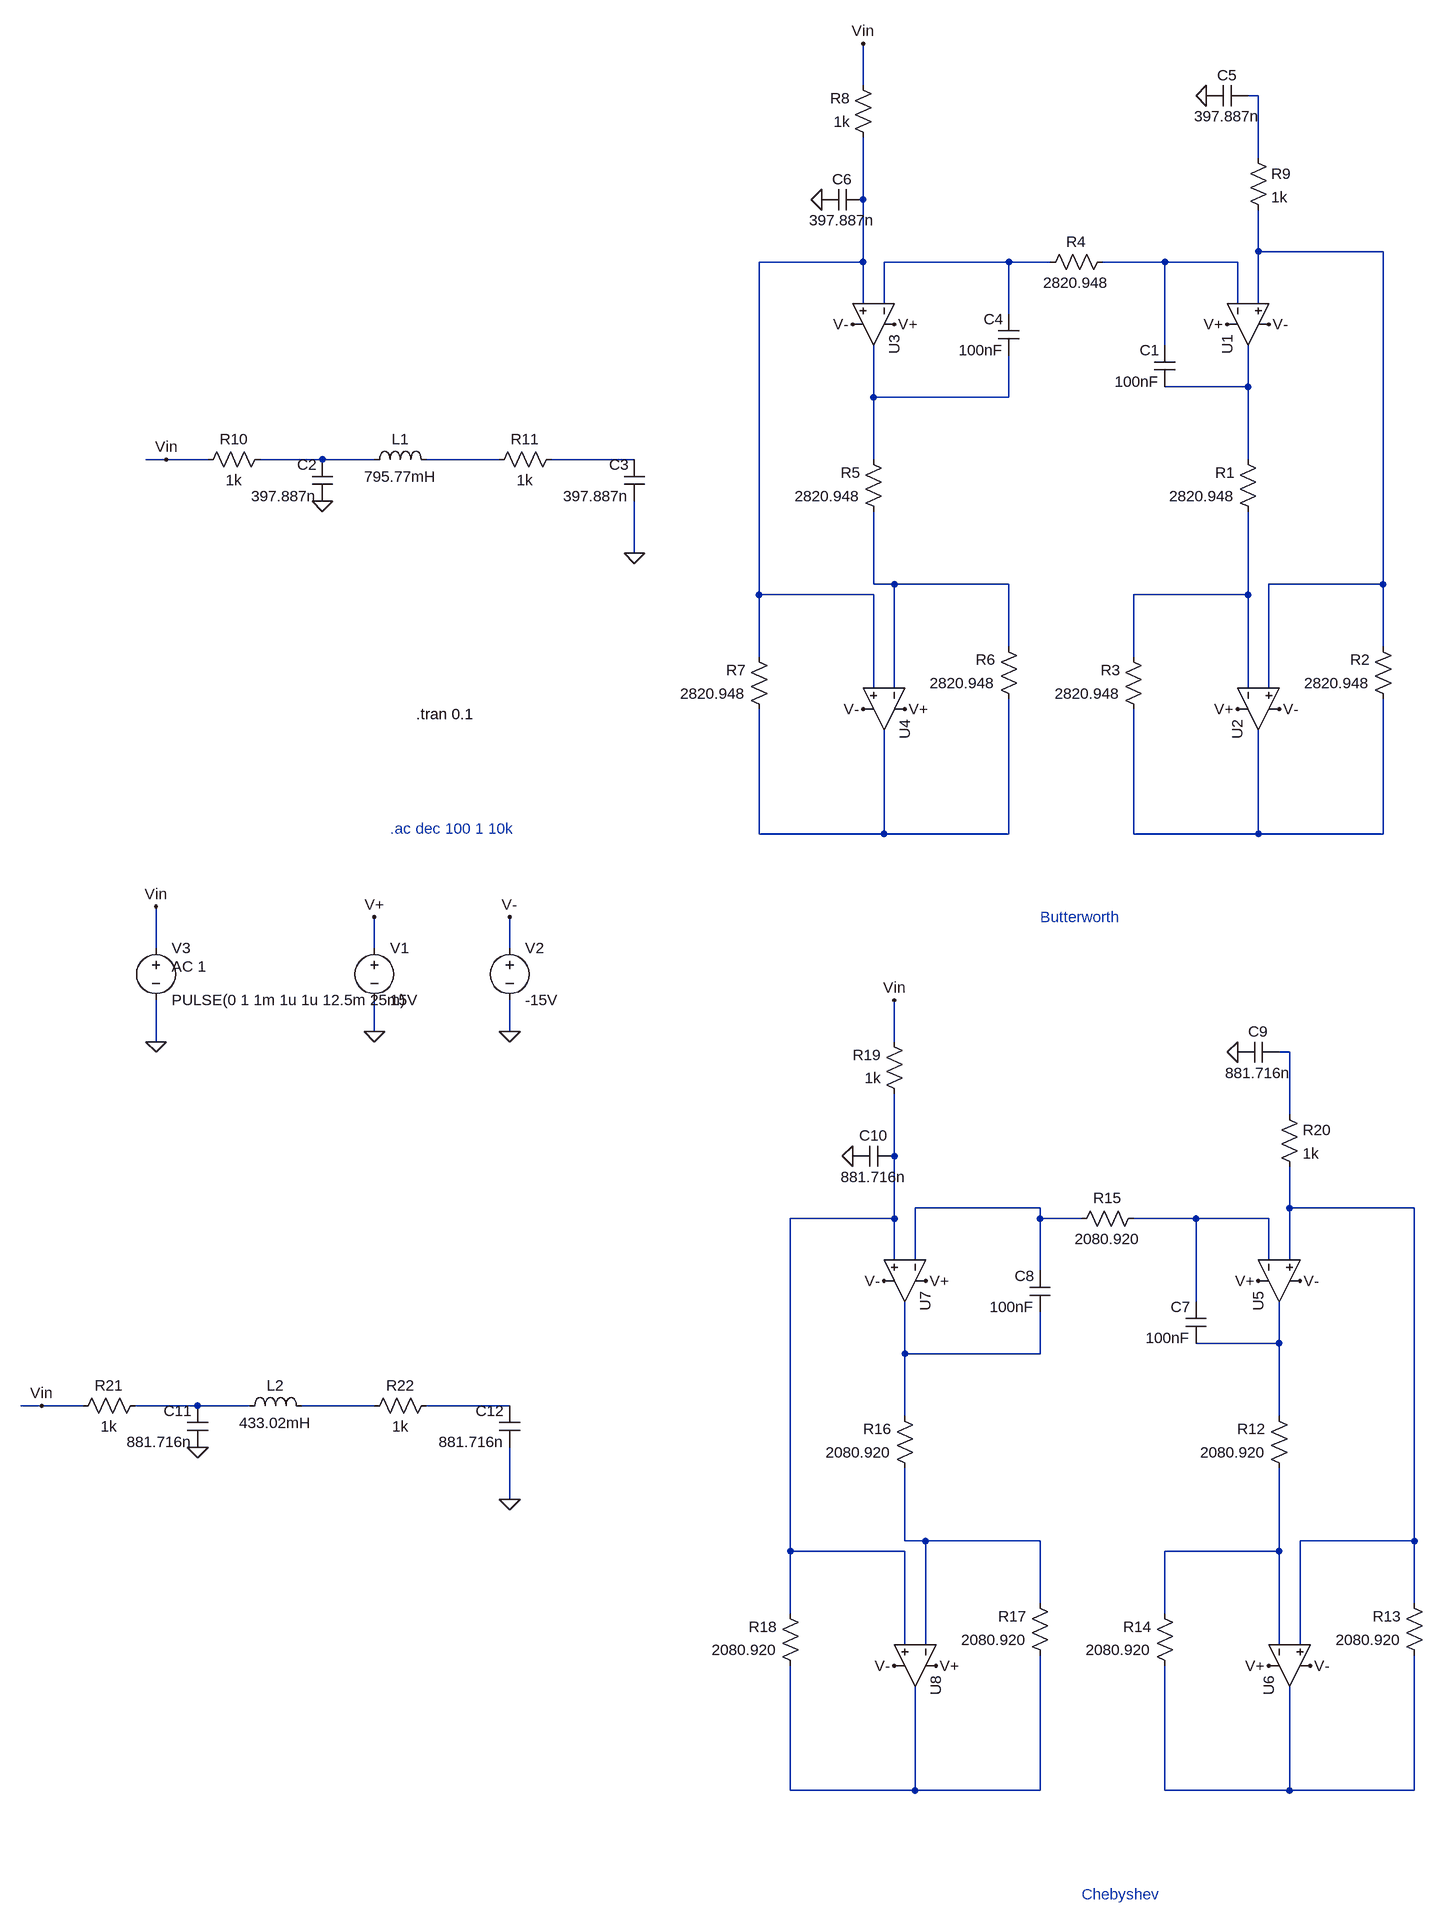
[diagram p0: schematic Draft2.asc]
Draft2.asc, the LTspice schematic file:
Version 4.1
SHEET 1 1396 1632
WIRE 528 -1168 528 -1232
WIRE 1136 -1152 1120 -1152
WIRE 1136 -1056 1136 -1152
WIRE 528 -992 528 -1088
WIRE 1136 -912 1136 -976
WIRE 1328 -912 1136 -912
WIRE 528 -896 528 -992
WIRE 528 -896 368 -896
WIRE 752 -896 560 -896
WIRE 816 -896 752 -896
WIRE 992 -896 896 -896
WIRE 1104 -896 992 -896
WIRE 528 -832 528 -896
WIRE 560 -832 560 -896
WIRE 1104 -832 1104 -896
WIRE 1136 -832 1136 -912
WIRE 752 -816 752 -896
WIRE 992 -768 992 -896
WIRE 1120 -704 1120 -768
WIRE 1120 -704 992 -704
WIRE 544 -688 544 -768
WIRE 752 -688 752 -752
WIRE 752 -688 544 -688
WIRE -544 -592 -576 -592
WIRE -480 -592 -544 -592
WIRE -304 -592 -400 -592
WIRE -224 -592 -304 -592
WIRE -32 -592 -144 -592
WIRE 176 -592 48 -592
WIRE 544 -592 544 -688
WIRE 1120 -592 1120 -704
WIRE 176 -448 176 -528
WIRE 544 -400 544 -512
WIRE 576 -400 544 -400
WIRE 752 -400 576 -400
WIRE 1328 -400 1328 -912
WIRE 1328 -400 1152 -400
WIRE 368 -384 368 -896
WIRE 544 -384 368 -384
WIRE 1120 -384 1120 -512
WIRE 1120 -384 944 -384
WIRE 752 -304 752 -400
WIRE 1328 -304 1328 -400
WIRE 368 -288 368 -384
WIRE 944 -288 944 -384
WIRE 544 -240 544 -384
WIRE 576 -240 576 -400
WIRE 1120 -240 1120 -384
WIRE 1152 -240 1152 -400
WIRE 368 -16 368 -208
WIRE 560 -16 560 -176
WIRE 560 -16 368 -16
WIRE 752 -16 752 -224
WIRE 752 -16 560 -16
WIRE 944 -16 944 -208
WIRE 1136 -16 1136 -176
WIRE 1136 -16 944 -16
WIRE 1328 -16 1328 -224
WIRE 1328 -16 1136 -16
WIRE -560 160 -560 96
WIRE -224 160 -224 112
WIRE -16 160 -16 112
WIRE -224 288 -224 240
WIRE -16 288 -16 240
WIRE -560 304 -560 240
WIRE 576 304 576 240
WIRE 1184 320 1168 320
WIRE 1184 416 1184 320
WIRE 576 480 576 384
WIRE 800 560 608 560
WIRE 1184 560 1184 496
WIRE 1376 560 1184 560
WIRE 576 576 576 480
WIRE 576 576 416 576
WIRE 800 576 800 560
WIRE 864 576 800 576
WIRE 1040 576 944 576
WIRE 1152 576 1040 576
WIRE 576 640 576 576
WIRE 608 640 608 560
WIRE 1152 640 1152 576
WIRE 1184 640 1184 560
WIRE 800 656 800 576
WIRE 1040 704 1040 576
WIRE 1168 768 1168 704
WIRE 1168 768 1040 768
WIRE 592 784 592 704
WIRE 800 784 800 720
WIRE 800 784 592 784
WIRE -736 864 -768 864
WIRE -672 864 -736 864
WIRE -496 864 -592 864
WIRE -416 864 -496 864
WIRE -224 864 -336 864
WIRE -16 864 -144 864
WIRE 592 880 592 784
WIRE 1168 880 1168 768
WIRE -16 1008 -16 928
WIRE 592 1072 592 960
WIRE 624 1072 592 1072
WIRE 800 1072 624 1072
WIRE 1376 1072 1376 560
WIRE 1376 1072 1200 1072
WIRE 416 1088 416 576
WIRE 592 1088 416 1088
WIRE 1168 1088 1168 960
WIRE 1168 1088 992 1088
WIRE 800 1168 800 1072
WIRE 1376 1168 1376 1072
WIRE 416 1184 416 1088
WIRE 992 1184 992 1088
WIRE 592 1232 592 1088
WIRE 624 1232 624 1072
WIRE 1168 1232 1168 1088
WIRE 1200 1232 1200 1072
WIRE 416 1456 416 1264
WIRE 608 1456 608 1296
WIRE 608 1456 416 1456
WIRE 800 1456 800 1248
WIRE 800 1456 608 1456
WIRE 992 1456 992 1264
WIRE 1184 1456 1184 1296
WIRE 1184 1456 992 1456
WIRE 1376 1456 1376 1248
WIRE 1376 1456 1184 1456
FLAG -224 288 0
FLAG -16 288 0
FLAG -224 112 V+
FLAG -16 112 V-
FLAG 176 -448 0
FLAG 1104 -208 V+
FLAG 1088 -800 V+
FLAG 1168 -208 V-
FLAG 1152 -800 V-
FLAG 592 -208 V+
FLAG 576 -800 V+
FLAG 528 -208 V-
FLAG 512 -800 V-
FLAG 1056 -1152 0
FLAG 464 -992 0
FLAG -304 -528 0
FLAG 528 -1232 Vin
FLAG -560 304 0
FLAG -560 96 Vin
FLAG -544 -592 Vin
FLAG 1152 1264 V+
FLAG 1136 672 V+
FLAG 1216 1264 V-
FLAG 1200 672 V-
FLAG 640 1264 V+
FLAG 624 672 V+
FLAG 576 1264 V-
FLAG 560 672 V-
FLAG 1104 320 0
FLAG 512 480 0
FLAG 576 240 Vin
FLAG -16 1008 0
FLAG -496 928 0
FLAG -736 864 Vin
SYMBOL voltage -224 144 R0
WINDOW 123 0 0 Left 0
WINDOW 39 0 0 Left 0
SYMATTR InstName V1
SYMATTR Value 15V
SYMBOL voltage -16 144 R0
WINDOW 123 0 0 Left 0
WINDOW 39 0 0 Left 0
SYMATTR InstName V2
SYMATTR Value -15V
SYMBOL ind -240 -576 R270
WINDOW 0 32 56 VTop 2
WINDOW 3 5 56 VBottom 2
SYMATTR InstName L1
SYMATTR Value 795.77mH
SYMBOL res 1136 -496 R180
WINDOW 0 36 76 Left 2
WINDOW 3 36 40 Left 2
SYMATTR InstName R1
SYMATTR Value 2820.948
SYMBOL res 1344 -208 R180
WINDOW 0 36 76 Left 2
WINDOW 3 36 40 Left 2
SYMATTR InstName R2
SYMATTR Value 2820.948
SYMBOL res 960 -192 R180
WINDOW 0 36 76 Left 2
WINDOW 3 36 40 Left 2
SYMATTR InstName R3
SYMATTR Value 2820.948
SYMBOL res 912 -912 R90
WINDOW 0 0 56 VBottom 2
WINDOW 3 32 56 VTop 2
SYMATTR InstName R4
SYMATTR Value 2820.948
SYMBOL cap 1008 -704 R180
WINDOW 0 24 56 Left 2
WINDOW 3 24 8 Left 2
SYMATTR InstName C1
SYMATTR Value 100nF
SYMBOL OpAmps\\UniversalOpAmp2 1120 -800 M90
SYMATTR InstName U1
SYMBOL cap -288 -528 R180
WINDOW 0 24 56 Left 2
WINDOW 3 24 8 Left 2
SYMATTR InstName C2
SYMATTR Value 397.887n
SYMBOL cap 192 -528 R180
WINDOW 0 24 56 Left 2
WINDOW 3 24 8 Left 2
SYMATTR InstName C3
SYMATTR Value 397.887n
SYMBOL OpAmps\\UniversalOpAmp2 1136 -208 M90
SYMATTR InstName U2
SYMBOL res 560 -496 R180
WINDOW 0 36 76 Left 2
WINDOW 3 36 40 Left 2
SYMATTR InstName R5
SYMATTR Value 2820.948
SYMBOL res 768 -208 R180
WINDOW 0 36 76 Left 2
WINDOW 3 36 40 Left 2
SYMATTR InstName R6
SYMATTR Value 2820.948
SYMBOL res 384 -192 R180
WINDOW 0 36 76 Left 2
WINDOW 3 36 40 Left 2
SYMATTR InstName R7
SYMATTR Value 2820.948
SYMBOL cap 768 -752 R180
WINDOW 0 24 56 Left 2
WINDOW 3 24 8 Left 2
SYMATTR InstName C4
SYMATTR Value 100nF
SYMBOL OpAmps\\UniversalOpAmp2 544 -800 R90
SYMATTR InstName U3
SYMBOL OpAmps\\UniversalOpAmp2 560 -208 R90
SYMATTR InstName U4
SYMBOL res 544 -1072 R180
WINDOW 0 36 76 Left 2
WINDOW 3 36 40 Left 2
SYMATTR InstName R8
SYMATTR Value 1k
SYMBOL cap 1120 -1168 R90
WINDOW 0 0 32 VBottom 2
WINDOW 3 32 32 VTop 2
SYMATTR InstName C5
SYMATTR Value 397.887n
SYMBOL cap 528 -1008 R90
WINDOW 0 0 32 VBottom 2
WINDOW 3 32 32 VTop 2
SYMATTR InstName C6
SYMATTR Value 397.887n
SYMBOL voltage -560 144 R0
WINDOW 123 24 44 Left 2
WINDOW 39 0 0 Left 0
SYMATTR Value2 AC 1
SYMATTR InstName V3
SYMATTR Value PULSE(0 1 1m 1u 1u 12.5m 25m)
SYMBOL res 1120 -1072 R0
SYMATTR InstName R9
SYMATTR Value 1k
SYMBOL res -384 -608 R90
WINDOW 0 0 56 VBottom 2
WINDOW 3 32 56 VTop 2
SYMATTR InstName R10
SYMATTR Value 1k
SYMBOL res 64 -608 R90
WINDOW 0 0 56 VBottom 2
WINDOW 3 32 56 VTop 2
SYMATTR InstName R11
SYMATTR Value 1k
SYMBOL res 1184 976 R180
WINDOW 0 36 76 Left 2
WINDOW 3 36 40 Left 2
SYMATTR InstName R12
SYMATTR Value 2080.920
SYMBOL res 1392 1264 R180
WINDOW 0 36 76 Left 2
WINDOW 3 36 40 Left 2
SYMATTR InstName R13
SYMATTR Value 2080.920
SYMBOL res 1008 1280 R180
WINDOW 0 36 76 Left 2
WINDOW 3 36 40 Left 2
SYMATTR InstName R14
SYMATTR Value 2080.920
SYMBOL res 960 560 R90
WINDOW 0 0 56 VBottom 2
WINDOW 3 32 56 VTop 2
SYMATTR InstName R15
SYMATTR Value 2080.920
SYMBOL cap 1056 768 R180
WINDOW 0 24 56 Left 2
WINDOW 3 24 8 Left 2
SYMATTR InstName C7
SYMATTR Value 100nF
SYMBOL OpAmps\\UniversalOpAmp2 1168 672 M90
SYMATTR InstName U5
SYMBOL OpAmps\\UniversalOpAmp2 1184 1264 M90
SYMATTR InstName U6
SYMBOL res 608 976 R180
WINDOW 0 36 76 Left 2
WINDOW 3 36 40 Left 2
SYMATTR InstName R16
SYMATTR Value 2080.920
SYMBOL res 816 1264 R180
WINDOW 0 36 76 Left 2
WINDOW 3 36 40 Left 2
SYMATTR InstName R17
SYMATTR Value 2080.920
SYMBOL res 432 1280 R180
WINDOW 0 36 76 Left 2
WINDOW 3 36 40 Left 2
SYMATTR InstName R18
SYMATTR Value 2080.920
SYMBOL cap 816 720 R180
WINDOW 0 24 56 Left 2
WINDOW 3 24 8 Left 2
SYMATTR InstName C8
SYMATTR Value 100nF
SYMBOL OpAmps\\UniversalOpAmp2 592 672 R90
SYMATTR InstName U7
SYMBOL OpAmps\\UniversalOpAmp2 608 1264 R90
SYMATTR InstName U8
SYMBOL res 592 400 R180
WINDOW 0 36 76 Left 2
WINDOW 3 36 40 Left 2
SYMATTR InstName R19
SYMATTR Value 1k
SYMBOL cap 1168 304 R90
WINDOW 0 0 32 VBottom 2
WINDOW 3 32 32 VTop 2
SYMATTR InstName C9
SYMATTR Value 881.716n
SYMBOL cap 576 464 R90
WINDOW 0 0 32 VBottom 2
WINDOW 3 32 32 VTop 2
SYMATTR InstName C10
SYMATTR Value 881.716n
SYMBOL res 1168 400 R0
SYMATTR InstName R20
SYMATTR Value 1k
SYMBOL ind -432 880 R270
WINDOW 0 32 56 VTop 2
WINDOW 3 5 56 VBottom 2
SYMATTR InstName L2
SYMATTR Value 433.02mH
SYMBOL cap -480 928 R180
WINDOW 0 24 56 Left 2
WINDOW 3 24 8 Left 2
SYMATTR InstName C11
SYMATTR Value 881.716n
SYMBOL cap 0 928 R180
WINDOW 0 24 56 Left 2
WINDOW 3 24 8 Left 2
SYMATTR InstName C12
SYMATTR Value 881.716n
SYMBOL res -576 848 R90
WINDOW 0 0 56 VBottom 2
WINDOW 3 32 56 VTop 2
SYMATTR InstName R21
SYMATTR Value 1k
SYMBOL res -128 848 R90
WINDOW 0 0 56 VBottom 2
WINDOW 3 32 56 VTop 2
SYMATTR InstName R22
SYMATTR Value 1k
TEXT -200 -24 Left 2 ;.ac dec 100 1 10k
TEXT 800 112 Left 2 ;Butterworth
TEXT 864 1616 Left 2 ;Chebyshev
TEXT -160 -200 Left 2 !.tran 0.1

The netlist it stands for:
* Draft2.asc
V1 V+ 0 15V
V2 V- 0 -15V
L1 N008 N009 795.77mH
R1 N012 N006 2820.948
R2 N014 N003 2820.948
R3 N014 N012 2820.948
R4 N005 N004 2820.948
C1 N006 N005 100nF
X§U1 N003 N005 V+ V- N006 level2 Avol=1Meg GBW=10Meg Slew=10Meg Ilimit=25m Rail=0 Vos=0 En=0 Enk=0 In=0 Ink=0 Rin=500Meg  ; pins In+ In- V+ V- OUT
C2 0 N008 397.887n
C3 0 N010 397.887n
X§U2 N003 N012 V+ V- N014 level2 Avol=1Meg GBW=10Meg Slew=10Meg Ilimit=25m Rail=0 Vos=0 En=0 Enk=0 In=0 Ink=0 Rin=500Meg  ; pins In+ In- V+ V- OUT
R5 N011 N007 2820.948
R6 N013 N011 2820.948
R7 N013 N002 2820.948
C4 N007 N004 100nF
X§U3 N002 N004 V+ V- N007 level2 Avol=1Meg GBW=10Meg Slew=10Meg Ilimit=25m Rail=0 Vos=0 En=0 Enk=0 In=0 Ink=0 Rin=500Meg  ; pins In+ In- V+ V- OUT
X§U4 N002 N011 V+ V- N013 level2 Avol=1Meg GBW=10Meg Slew=10Meg Ilimit=25m Rail=0 Vos=0 En=0 Enk=0 In=0 Ink=0 Rin=500Meg  ; pins In+ In- V+ V- OUT
R8 N002 Vin 1k
C5 N001 0 397.887n
C6 N002 0 397.887n
V3 Vin 0 PULSE(0 1 1m 1u 1u 12.5m 25m) AC 1
R9 N001 N003 1k
R10 N008 Vin 1k
R11 N010 N009 1k
R12 N026 N020 2080.920
R13 N028 N018 2080.920
R14 N028 N026 2080.920
R15 N019 N017 2080.920
C7 N020 N019 100nF
X§U5 N018 N019 V+ V- N020 level2 Avol=1Meg GBW=10Meg Slew=10Meg Ilimit=25m Rail=0 Vos=0 En=0 Enk=0 In=0 Ink=0 Rin=500Meg  ; pins In+ In- V+ V- OUT
X§U6 N018 N026 V+ V- N028 level2 Avol=1Meg GBW=10Meg Slew=10Meg Ilimit=25m Rail=0 Vos=0 En=0 Enk=0 In=0 Ink=0 Rin=500Meg  ; pins In+ In- V+ V- OUT
R16 N025 N021 2080.920
R17 N027 N025 2080.920
R18 N027 N016 2080.920
C8 N021 N017 100nF
X§U7 N016 N017 V+ V- N021 level2 Avol=1Meg GBW=10Meg Slew=10Meg Ilimit=25m Rail=0 Vos=0 En=0 Enk=0 In=0 Ink=0 Rin=500Meg  ; pins In+ In- V+ V- OUT
X§U8 N016 N025 V+ V- N027 level2 Avol=1Meg GBW=10Meg Slew=10Meg Ilimit=25m Rail=0 Vos=0 En=0 Enk=0 In=0 Ink=0 Rin=500Meg  ; pins In+ In- V+ V- OUT
R19 N016 Vin 1k
C9 N015 0 881.716n
C10 N016 0 881.716n
R20 N015 N018 1k
L2 N022 N023 433.02mH
C11 0 N022 881.716n
C12 0 N024 881.716n
R21 N022 Vin 1k
R22 N024 N023 1k
* .ac dec 100 1 10k
* Butterworth
* Chebyshev
.tran 0.1
.lib UniversalOpAmp2.lib
.backanno
.end